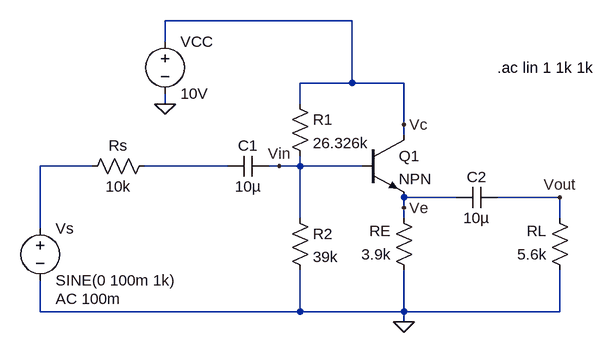
[diagram p0: schematic Common Collector - Vin, Iin, Rin.asc]
Common Collector - Vin, Iin, Rin.asc, the LTspice schematic file:
Version 4
SHEET 1 964 680
WIRE 32 -64 -256 -64
WIRE -256 -32 -256 -64
WIRE 32 32 32 -64
WIRE 32 32 -48 32
WIRE 112 32 32 32
WIRE -256 64 -256 48
WIRE -48 64 -48 32
WIRE 112 96 112 32
WIRE 112 112 112 96
WIRE -368 160 -448 160
WIRE -160 160 -288 160
WIRE -80 160 -96 160
WIRE -48 160 -48 144
WIRE -48 160 -80 160
WIRE 48 160 -48 160
WIRE 192 208 112 208
WIRE 352 208 256 208
WIRE 112 224 112 208
WIRE -48 240 -48 160
WIRE 112 240 112 224
WIRE 352 240 352 208
WIRE -448 256 -448 160
WIRE -448 384 -448 336
WIRE -48 384 -48 320
WIRE -48 384 -448 384
WIRE 112 384 112 320
WIRE 112 384 -48 384
WIRE 352 384 352 320
WIRE 352 384 112 384
WIRE 112 400 112 384
FLAG -256 64 0
FLAG 352 208 Vout
FLAG 112 96 Vc
FLAG 112 224 Ve
FLAG 112 400 0
FLAG -80 160 Vin
SYMBOL voltage -256 -48 R0
SYMATTR InstName VCC
SYMATTR Value 10V
SYMBOL voltage -448 240 R0
WINDOW 123 24 124 Left 2
WINDOW 39 0 0 Left 0
SYMATTR Value2 AC 100m
SYMATTR InstName Vs
SYMATTR Value SINE(0 100m 1k)
SYMBOL res -64 224 R0
SYMATTR InstName R2
SYMATTR Value 39k
SYMBOL res -272 144 R90
WINDOW 0 0 56 VBottom 2
WINDOW 3 32 56 VTop 2
SYMATTR InstName Rs
SYMATTR Value 10k
SYMBOL res 128 336 R180
WINDOW 0 36 76 Left 2
WINDOW 3 36 40 Left 2
SYMATTR InstName RE
SYMATTR Value 3.9k
SYMBOL res 368 336 R180
WINDOW 0 36 76 Left 2
WINDOW 3 36 40 Left 2
SYMATTR InstName RL
SYMATTR Value 5.6k
SYMBOL cap -96 144 R90
WINDOW 0 0 32 VBottom 2
WINDOW 3 32 32 VTop 2
SYMATTR InstName C1
SYMATTR Value 10µ
SYMBOL cap 256 192 R90
WINDOW 0 0 32 VBottom 2
WINDOW 3 32 32 VTop 2
SYMATTR InstName C2
SYMATTR Value 10µ
SYMBOL npn 48 112 R0
SYMATTR InstName Q1
SYMBOL res -64 48 R0
SYMATTR InstName R1
SYMATTR Value 26.326k
TEXT 256 8 Left 2 !.ac lin 1 1k 1k

The netlist it stands for:
* Common Collector - Vin, Iin, Rin.asc
VCC Vc 0 10V
Vs N001 0 SINE(0 100m 1k) AC 100m
R2 Vin 0 39k
Rs N002 N001 10k
RE 0 Ve 3.9k
RL 0 Vout 5.6k
C1 Vin N002 10µ
C2 Vout Ve 10µ
Q1 Vc Vin Ve 0 NPN
R1 Vc Vin 26.326k
.model NPN NPN
.model PNP PNP
.lib standard.bjt
.ac lin 1 1k 1k
.backanno
.end